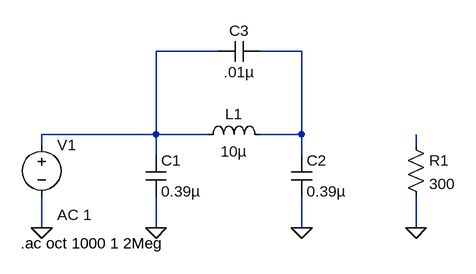
[diagram p0: schematic MPPT-Out-PI-Filter.asc]
MPPT-Out-PI-Filter.asc, the LTspice schematic file:
Version 4
SHEET 1 880 680
WIRE 272 0 176 0
WIRE 400 0 336 0
WIRE 176 128 176 0
WIRE 176 128 0 128
WIRE 256 128 176 128
WIRE 400 128 400 0
WIRE 400 128 336 128
WIRE 0 144 0 128
WIRE 576 144 576 128
WIRE 176 160 176 128
WIRE 400 160 400 128
WIRE 0 272 0 224
WIRE 176 272 176 224
WIRE 400 272 400 224
WIRE 576 272 576 224
FLAG 176 272 0
FLAG 400 272 0
FLAG 0 272 0
FLAG 576 272 0
SYMBOL cap 160 160 R0
SYMATTR InstName C1
SYMATTR Value 0.39µ
SYMATTR SpiceLine Rser=0.005
SYMBOL cap 384 160 R0
SYMATTR InstName C2
SYMATTR Value 0.39µ
SYMATTR SpiceLine Rser=0.005
SYMBOL ind 240 144 R270
WINDOW 0 32 56 VTop 2
WINDOW 3 5 56 VBottom 2
SYMATTR InstName L1
SYMATTR Value 10µ
SYMATTR SpiceLine Rser=.0468
SYMBOL voltage 0 128 R0
WINDOW 123 24 124 Left 2
WINDOW 39 0 0 Left 2
SYMATTR Value2 AC 1
SYMATTR InstName V1
SYMATTR Value ""
SYMBOL res 560 128 R0
SYMATTR InstName R1
SYMATTR Value 300
SYMBOL cap 336 -16 R90
WINDOW 0 0 32 VBottom 2
WINDOW 3 32 32 VTop 2
SYMATTR InstName C3
SYMATTR Value .01µ
SYMATTR SpiceLine Rser=0.005
TEXT -32 296 Left 2 !.ac oct 1000 1 2Meg

The netlist it stands for:
* MPPT-Out-PI-Filter.asc
C1 N001 0 0.39µ Rser=0.005
C2 N002 0 0.39µ Rser=0.005
L1 N001 N002 10µ Rser=.0468
V1 N001 0 AC 1
R1 N003 0 300
C3 N002 N001 .01µ Rser=0.005
.ac oct 1000 1 2Meg
.backanno
.end